# Altium schematic sheet Debugger.SchDoc
size A4
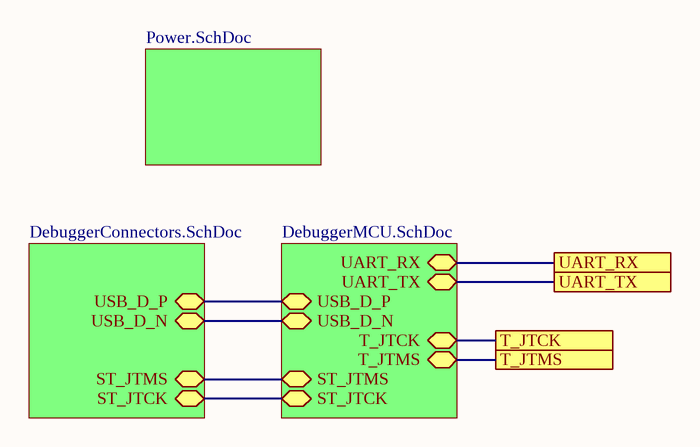
[diagram p0: Debugger.SchDoc]

## Sub-sheets
CONNECTORS = DebuggerConnectors.SchDoc: USB_D_P (bidir), USB_D_N (bidir), ST_JTMS (bidir), ST_JTCK (bidir)
MCU = DebuggerMCU.SchDoc: UART_RX (bidir), UART_TX (bidir), USB_D_P (bidir), USB_D_N (bidir), T_JTCK (bidir), T_JTMS (bidir), ST_JTMS (bidir), ST_JTCK (bidir)
POWER = Power.SchDoc: no entries

## Ports
T_JTCK, T_JTMS, UART_RX, UART_TX

## Nets
T_JTCK: port T_JTCK, sheet MCU/T_JTCK
T_JTMS: port T_JTMS, sheet MCU/T_JTMS
UART_RX: port UART_RX, sheet MCU/UART_RX
UART_TX: port UART_TX, sheet MCU/UART_TX
(unnamed): sheet MCU/USB_D_P, sheet CONNECTORS/USB_D_P
(unnamed): sheet MCU/USB_D_N, sheet CONNECTORS/USB_D_N
(unnamed): sheet MCU/ST_JTMS, sheet CONNECTORS/ST_JTMS
(unnamed): sheet MCU/ST_JTCK, sheet CONNECTORS/ST_JTCK